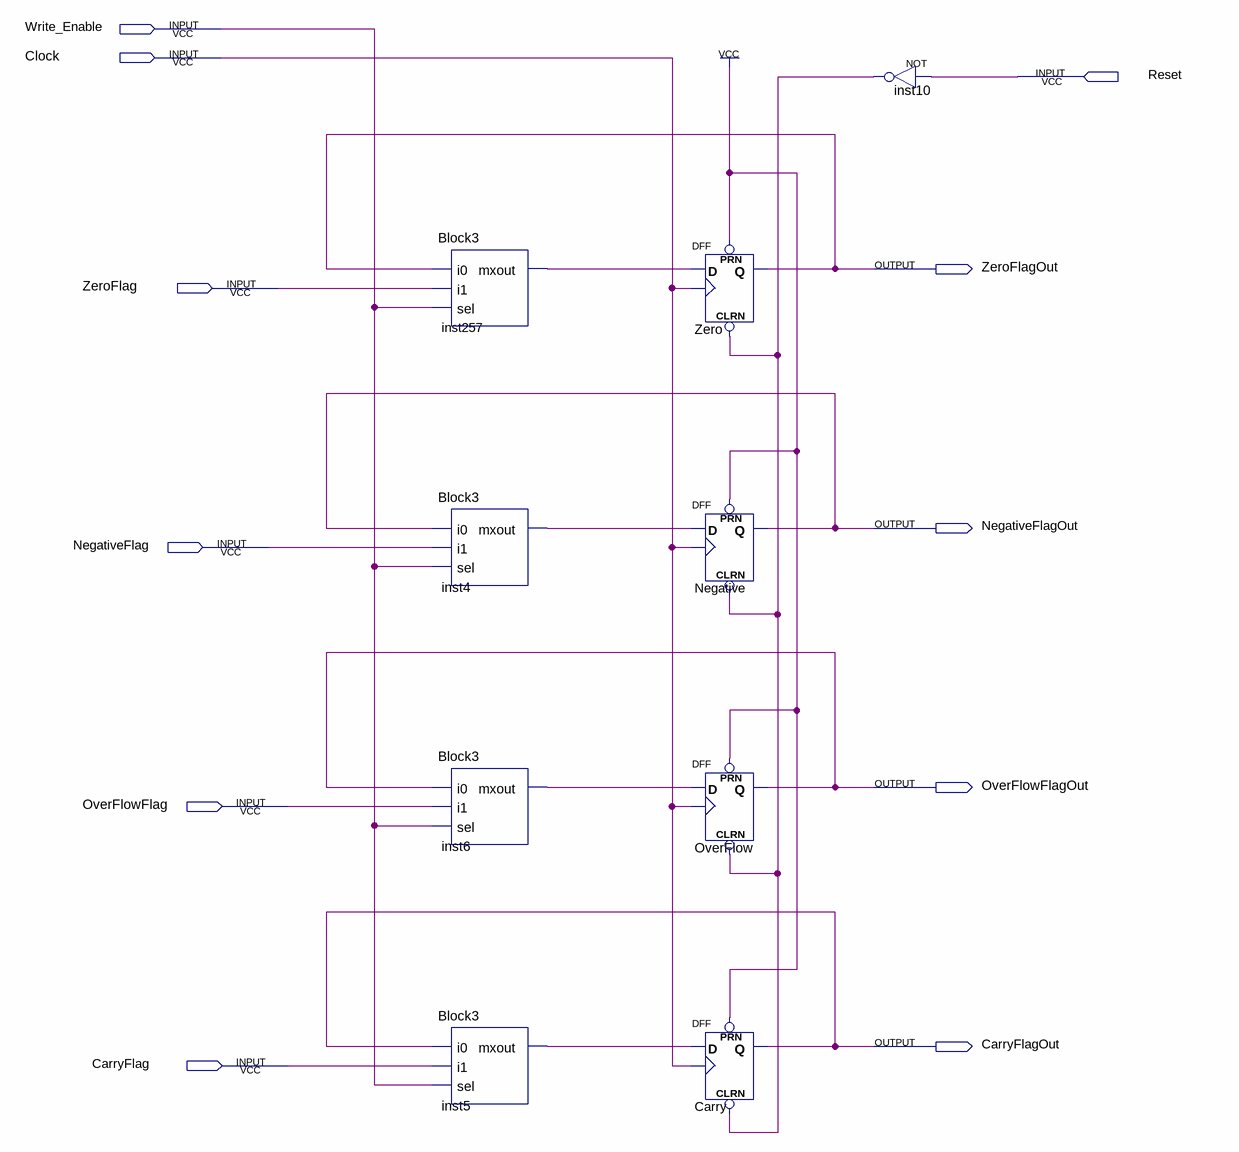
[diagram p0: schematic sheet]
// Quartus schematic Flag_Registers.bdf as structural Verilog: 9 symbols, 11 pins
module Flag_Registers (
  input  Write_Enable,
  input  Clock,
  input  Reset,
  input  ZeroFlag,
  input  NegativeFlag,
  input  OverFlowFlag,
  input  CarryFlag,
  output ZeroFlagOut,
  output NegativeFlagOut,
  output OverFlowFlagOut,
  output CarryFlagOut
);

  wire inst4_mxout, inst5_mxout, inst6_mxout, inst10_out, inst257_mxout;

  Block3 inst257 (.i0(ZeroFlagOut), .i1(ZeroFlag), .sel(Write_Enable), .mxout(inst257_mxout));
  Block3 inst4 (.i0(NegativeFlagOut), .i1(NegativeFlag), .sel(Write_Enable), .mxout(inst4_mxout));
  Block3 inst6 (.i0(OverFlowFlagOut), .i1(OverFlowFlag), .sel(Write_Enable), .mxout(inst6_mxout));
  Block3 inst5 (.i0(CarryFlagOut), .i1(CarryFlag), .sel(Write_Enable), .mxout(inst5_mxout));
  DFF Zero (.CLRN(inst10_out), .CLK(Clock), .D(inst257_mxout), .PRN(1'b1), .Q(ZeroFlagOut));
  DFF Negative (.CLRN(inst10_out), .CLK(Clock), .D(inst4_mxout), .PRN(1'b1), .Q(NegativeFlagOut));
  DFF OverFlow (.CLRN(inst10_out), .CLK(Clock), .D(inst6_mxout), .PRN(1'b1), .Q(OverFlowFlagOut));
  DFF Carry (.CLRN(inst10_out), .CLK(Clock), .D(inst5_mxout), .PRN(1'b1), .Q(CarryFlagOut));
  not inst10 (inst10_out, Reset);
endmodule
